# Altium schematic sheet 12_PERIPHERALS.SchDoc: =TitleParameter
size A3; Address: Crete IL; Organization: ASISGUARD; Address1: Kemalpasa, Kemalpasa Cd. No:290 D:292H, 35060 Bornova/Izmir/Turkey
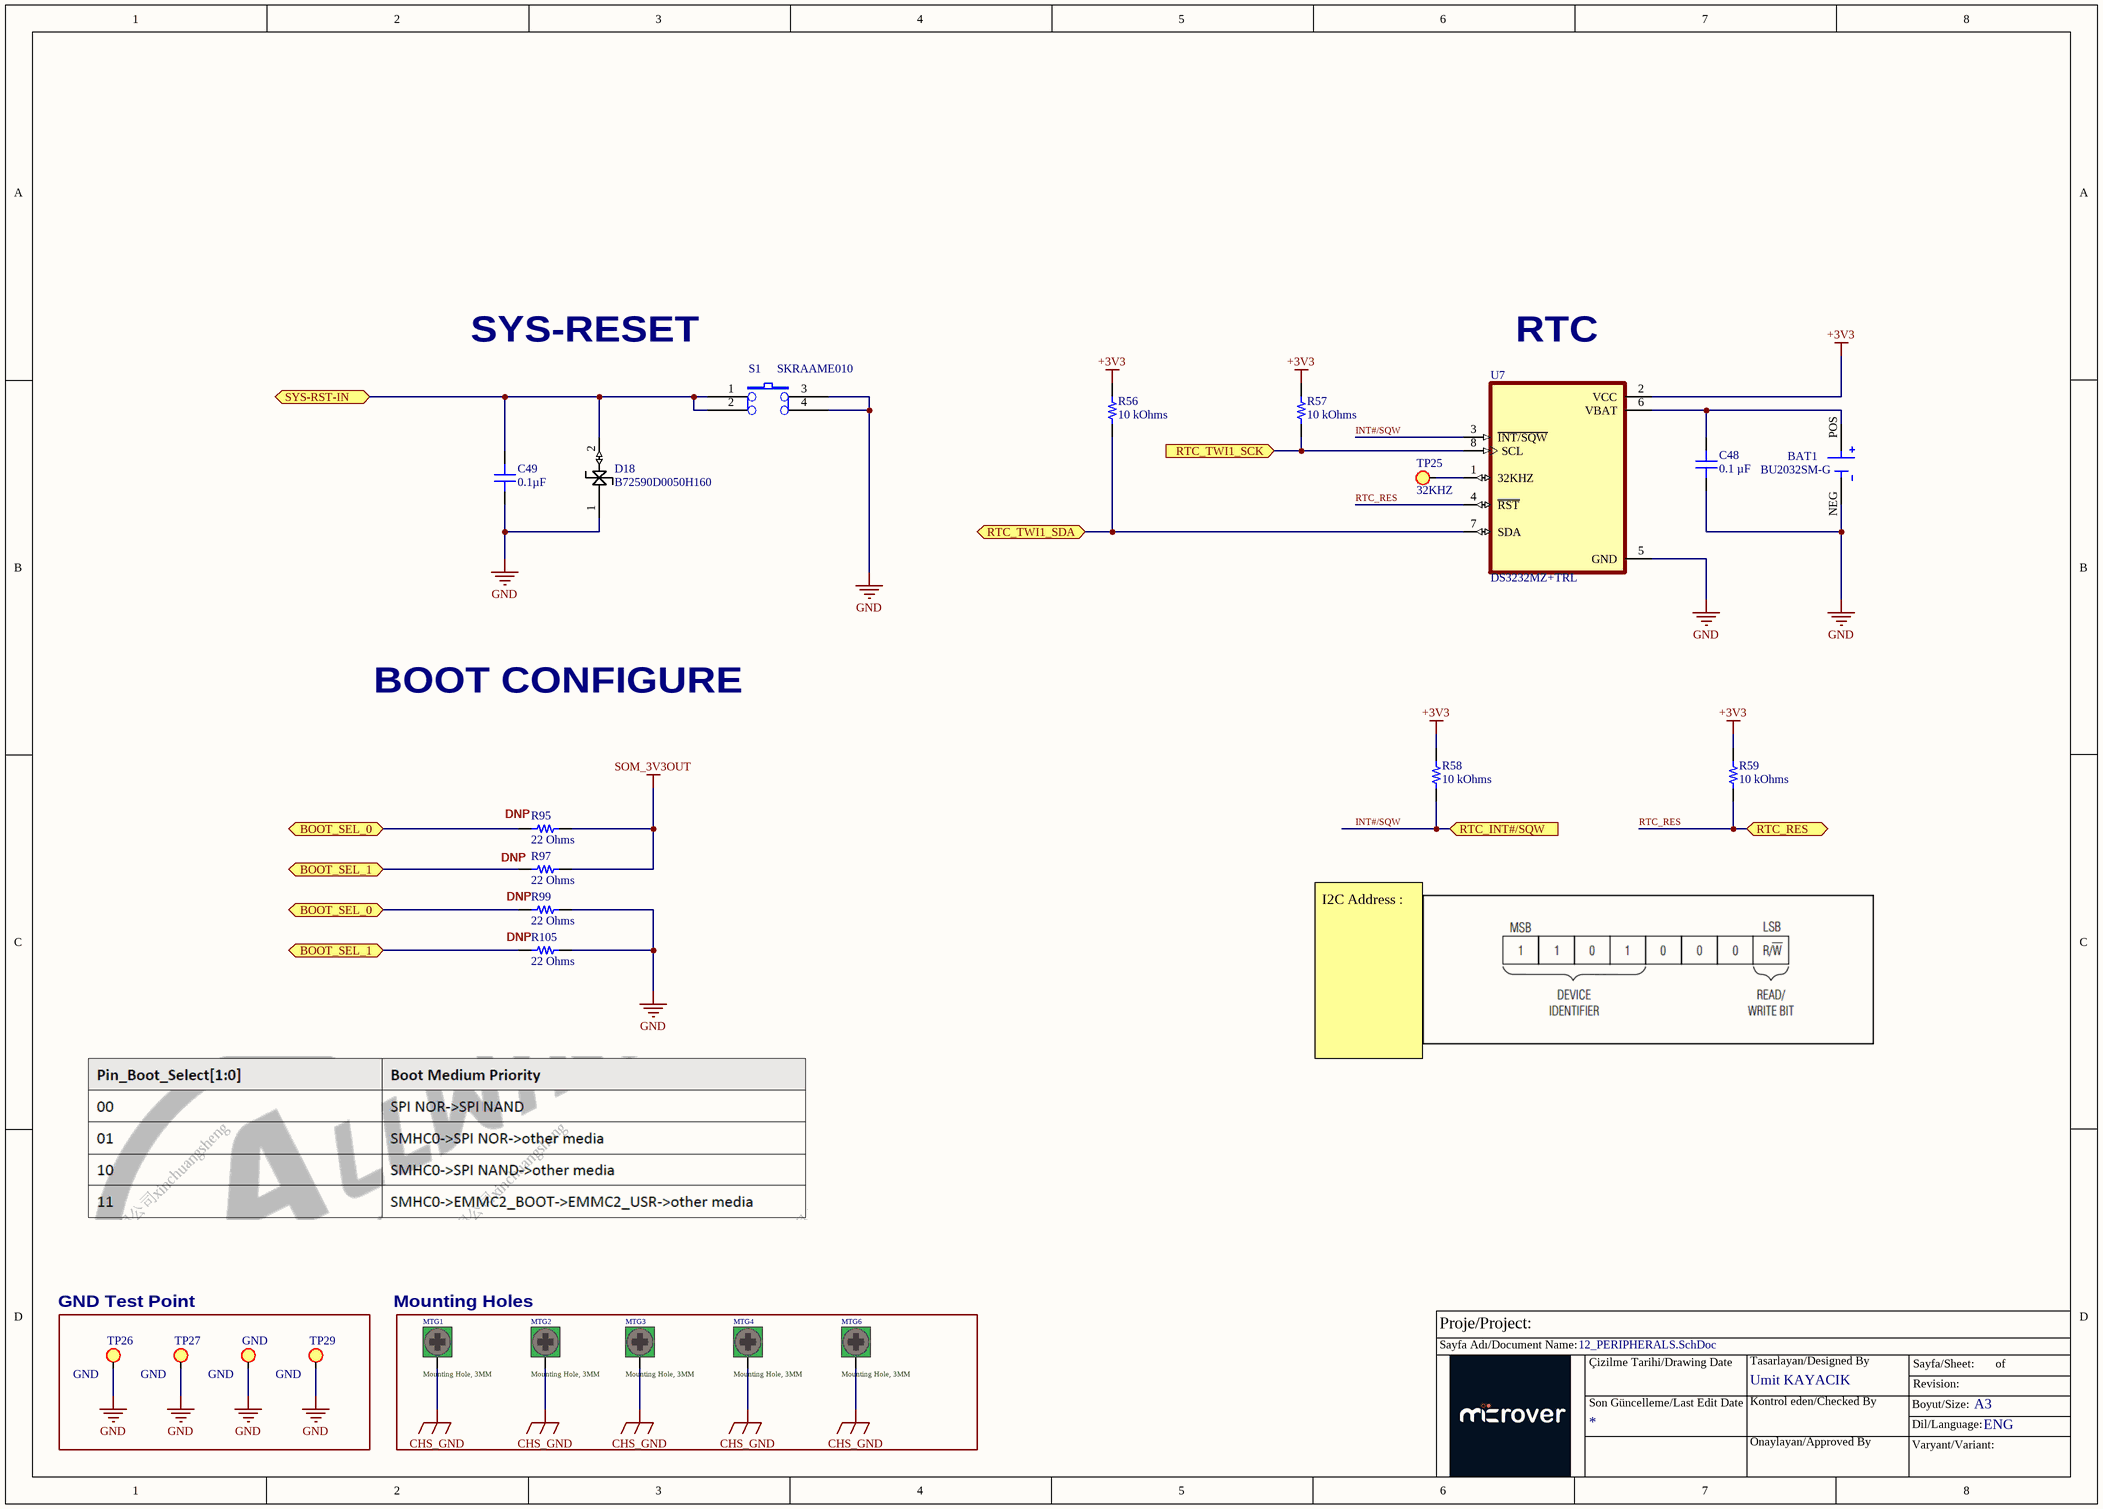
[diagram p0: 12_PERIPHERALS.SchDoc]

## Parts
BAT1  BU2032SM-G  [BAT_BU2032SM-G]
C48  0.1 µF  [CAP 0402_1005]
C49  0.1µF  [CAP 0603_1608]
D18  B72590D0050H160  [SOD1005X60N]
GND  GND  [TEST_POINT]
MTG1  Mounting Hole, 3MM  [MTG-PTH-3MM]  (no BOM)
MTG2  Mounting Hole, 3MM  [MTG-PTH-3MM]  (no BOM)
MTG3  Mounting Hole, 3MM  [MTG-PTH-3MM]  (no BOM)
MTG4  Mounting Hole, 3MM  [MTG-PTH-3MM]  (no BOM)
MTG6  Mounting Hole, 3MM  [MTG-PTH-3MM]  (no BOM)
R56  10 kOhms  [RES 0402_1005]
R57  10 kOhms  [RES 0402_1005]
R58  10 kOhms  [RES 0402_1005]
R59  10 kOhms  [RES 0402_1005]
R95  22 Ohms  [RES 0402_1005]
R97  22 Ohms  [RES 0402_1005]
R99  22 Ohms  [RES 0402_1005]
R105  22 Ohms  [RES 0402_1005]
S1  SKRAAME010  [SKRAAME010 - duplicate]
TP25  32KHZ  [TEST_POINT]
TP26  GND  [TEST_POINT]
TP27  GND  [TEST_POINT]
TP29  GND  [TEST_POINT]
U7  DS3232MZ+TRL  [SOIC127P600X175-8N - duplicate1]

## Blocks framed on the sheet
GND Test Point: GND TP26 TP27 TP29
Mounting Holes: MTG1-MTG4 MTG6

## Ports
BOOT_SEL_0 (bidir), BOOT_SEL_1 (bidir), RTC_INT#/SQW (in), RTC_RES (bidir), RTC_TWI1_SCK (in), RTC_TWI1_SDA (bidir), SYS-RST-IN (bidir)

## Nets
+3V3: R56.2 R57.2 R58.2 R59.2 U7.2(VCC)
CHS_GND: MTG1.0 MTG2.0 MTG3.0 MTG4.0 MTG6.0
GND: BAT1.NEG C48.1 C49.1 D18.1(GND) GND.1(TP) R99.2 R105.2 S1.3 S1.4 TP26.1(TP) TP27.1(TP) TP29.1(TP) U7.5(GND)
SOM_3V3OUT: R95.2 R97.2
BOOT_SEL_0: R95.1 R99.1 ; port BOOT_SEL_0
BOOT_SEL_1: R97.1 R105.1 ; port BOOT_SEL_1
INT#/SQW: R58.1 U7.3(~{INT/SQW}) ; port RTC_INT#/SQW
RTC_RES: R59.1 U7.4(~{RST}) ; port RTC_RES
RTC_TWI1_SCK: R57.1 U7.8(SCL) ; port RTC_TWI1_SCK
RTC_TWI1_SDA: R56.1 U7.7(SDA) ; port RTC_TWI1_SDA
SYS-RST-IN: C49.2 D18.2(I/OLINE) S1.1 S1.2 ; port SYS-RST-IN
NetBAT1_POS: BAT1.POS C48.2 U7.6(VBAT)
NetTP25_1: TP25.1(TP) U7.1(32KHZ)

## Notes on the sheet
- SYS-RESET
- (near U7) RTC
- BOOT CONFIGURE
- (near R95) DNP
- (near R97) DNP
- (near R99) DNP
- (near R105) DNP
- I2C Address :
- Proje/Project:
- Sayfa Adı/Document Name:
- Çizilme Tarihi/Drawing Date
- Umit KAYACIK
- Tasarlayan/Designed By
- Sayfa/Sheet:
- Revision:
- of
- Son Güncelleme/Last Edit Date
- Kontrol eden/Checked By
- Onaylayan/Approved By
- Boyut/Size:
- Varyant/Variant:
- Dil/Language:
- A3
- ENG

## Library data of the parts
BAT1 = BU2032SM-G: Battery Holder Coin 20MM SMD; Manufacturer: Memory Protection Devices; Number of Cells: 1; Number of Contacts: 2NUMBER; Supplier 1: Digikey; Manufacturer Part Number: BU2032SM-G; RoHS: Yes; Category: Uncategorized; Stock 1: 17897; Pricing 1: 400=0.81163, 800=0.76195, 1200=0.71225, 2800=0.646, 10000=0.5963 (USD); Mount: Surface Mount,PCB; Case/Package: SMD/SMT; Contact Material: 153,157ConductorMaterial; Min Operating Temperature: -40°C; Max Operating Temperature: 315°C; Termination: SMD/SMT; Series: -; Packaging: Cut Tape; Height: 5.3mm; ComponentLink1URL: https://datasheet.ciiva.com/7613/bu2032sm-g-datasheet-7613472.pdf?src-supplier=Digikey; ComponentLink1Description: https://datasheet.ciiva.com/7613/bu2032sm-g-datasheet-7613472.pdf?src-supplier=Digikey; Supplier Part Number 1: BU2032SM-GTR-ND
C48 = 885012105001: CAP CER 0.1UF 6.3V X5R 0402; manufacturer: Würth Elektronik; Tolerance: ±20%; Part Number: 885012105001; Value: 0.1 µF; Applications: General Purpose; Capacitance: 0.1 µF; componentlink1description: Datasheet; componentlink1url: https://katalog.we-online.de/pbs/datasheet/885012105001.pdf; componentlink2description: DigiKey Link; componentlink2url: https://www.digikey.com/en/products/detail/würth-elektronik/885012105001/5453333; Device Package: 0402 (1005 Metric); lastupdated: 2/9/2024 8:04:37 PM; Lifecycle Status: Active; Minimum Order: 1; Mounting Type: Surface Mount, MLCC; Operating Temperature: -55°C ~ 85°C; Package / Case: 0402 (1005 Metric); packaging: TapeAndReel; partid: 1931; Part Status: Active; price: 0.01; series: WCAP-CSGP; Size / Dimension: 0.039" L x 0.020" W (1.00mm x 0.50mm); Supplier 1: DigiKey; Supplier Part Number 1: 732-7478-1-ND; Temperature Coefficient: X5R; Thickness (Max): 0.022" (0.55mm); Voltage - Rated: 6.3V
C49 = ESD35C104K4T2A-24: CAP CER 0.1UF 50V X7R 0603; manufacturer: AVX Corporation; Tolerance: ±10%; Part Number: ESD35C104K4T2A-24; Value: 0.1µF; Applications: Automotive, ESD Protection; Capacitance: 0.1µF; componentlink1description: Datasheet; componentlink1url: http://datasheets.avx.com/ESDSafe.pdf; componentlink2description: DigiKey Link; componentlink2url: http://digikey.com/product-detail/en/avx-corporation/ESD35C104K4T2A-24/478-8009-1-ND/3902999; Device Package: 0603 (1608 Metric); lastupdated: 9/2/2020 1:03:10 AM; Lifecycle Status: Active; Minimum Order: 1; Mounting Type: Surface Mount, MLCC; Operating Temperature: -55°C ~ 125°C; Package / Case: 0603 (1608 Metric); packaging: TapeAndReel; partid: 15342; Part Status: Active; price: 0.03; Ratings: AEC-Q200; series: ESD-SAFE™; Size / Dimension: 0.063" L x 0.031" W (1.60mm x 0.80mm); Supplier 1: DigiKey; Supplier Part Number 1: 478-8009-1-ND; Temperature Coefficient: X7R; Voltage - Rated: 50V
D18 = B72590D0050H160: VARISTOR 150V 0402; Manufacturer: TDK EPCOS; Supplier 1: Digikey; Manufacturer Part Number: B72590D0050H160; RoHS: Yes; Category: Varistors; Stock 1: 130000; Pricing 1: 10000=0,04977, 30000=0,04666, 50000=0,04137, 100000=0,04044, 250000=0,03982 (USD); ComponentLink1URL: https://datasheet.octopart.com/B72590D0050H160-EPCOS-datasheet-10468447.pdf?src-supplier=Newark; ComponentLink1Description: https://datasheet.octopart.com/B72590D0050H160-EPCOS-datasheet-10468447.pdf?src-supplier=Newark; ComponentLink2URL: https://en.tdk.eu/inf/75/ds/High_speed_series.pdf?src-supplier=Verical; ComponentLink2Description: https://en.tdk.eu/inf/75/ds/High_speed_series.pdf?src-supplier=Verical; ComponentLink3URL: http://www.farnell.com/datasheets/1706828.pdf?src-supplier=Newark; ComponentLink3Description: http://www.farnell.com/datasheets/1706828.pdf?src-supplier=Newark; ComponentLink4URL: https://en.tdk.eu/inf/75/ds/High_speed_series.pdf?src-supplier=Digikey; ComponentLink4Description: https://en.tdk.eu/inf/75/ds/High_speed_series.pdf?src-supplier=Digikey; ComponentLink5URL: https://www.tdk-electronics.tdk.com/inf/75/ds/High_speed_series.pdf?src-supplier=Digikey; ComponentLink5Description: https://www.tdk-electronics.tdk.com/inf/75/ds/High_speed_series.pdf?src-supplier=Digikey; ComponentLink6URL: https://en.tdk.eu/inf/75/ds/High_speed_series.pdf?src-supplier=Arrow+Electronics; ComponentLink6Description: https://en.tdk.eu/inf/75/ds/High_speed_series.pdf?src-supplier=Arrow+Electronics; ComponentLink7URL: https://en.tdk.eu/inf/75/ds/High_speed_series.pdf?src-supplier=Quest; ComponentLink7Description: https://en.tdk.eu/inf/75/ds/High_speed_series.pdf?src-supplier=Quest; ComponentLink8URL: https://datasheet.octopart.com/B72590D0050H160-EPCOS-datasheet-157245974.pdf?src-supplier=LKR; ComponentLink8Description: https://datasheet.octopart.com/B72590D0050H160-EPCOS-datasheet-157245974.pdf?src-supplier=LKR; ComponentLink9URL: https://en.tdk.eu/inf/75/ds/High_speed_series.pdf?src-supplier=TTI; ComponentLink9Description: https://en.tdk.eu/inf/75/ds/High_speed_series.pdf?src-supplier=TTI; Supplier Part Number 1: 495-3684-2-ND
GND TP25-TP27 TP29 = TP_1
MTG1-MTG4 MTG6 = MTG3MM
R56-R59 = RP73PF1E10KBTD: RES 10K OHM 0.1% 1/10W 0402; Manufacturer: TE Connectivity Passive Product; Power (Watts): 0.1W, 1/10W; Temperature Coefficient: ±25ppm/°C; Part Number: RP73PF1E10KBTD; Value: 10 kOhms; ComponentLink1Description: Datasheet; ComponentLink1URL: https://www.te.com/commerce/DocumentDelivery/DDEController?Action=srchrtrv&DocNm=1773272&DocType=DS&DocLang=English; ComponentLink2Description: DigiKey Link; ComponentLink2URL: https://www.digikey.com/en/products/detail/te-connectivity-passive-product/RP73PF1E10KBTD/8260957; Composition: Thin Film; Device Package: 0402 (1005 Metric); Height - Seated (Max): 0.014" (0.35mm); LastUpdated: 2/9/2024 8:30:24 PM; Lifecycle Status: Active; Minimum Order: 1; Number of Terminations: 2; Operating Temperature: -55°C ~ 155°C; Package / Case: 0402 (1005 Metric); Packaging: TapeAndReel; PartId: 2434; Part Status: Active; Price: 0.08; Resistance: 10 kOhms; Series: RP73, Holsworthy; Size / Dimension: 0.039" L x 0.020" W (1.00mm x 0.50mm); Supplier 1: DigiKey; Supplier Part Number 1: A127415CT-ND; Supplier Device Package: 0402; Tolerance: ±0.1%
R95 R97 R99 R105 = RC0402FR-0722RP: RES 22 OHM 1% 1/16W 0402; Manufacturer: Yageo; Power (Watts): 0.063W, 1/16W; Ratings: 7C1 RoHS w/out Exemption (100% Pb-Free); Temperature Coefficient: ±100ppm/°C; Part Number: RC0402FR-0722RP; Value: 22 Ohms; ComponentLink1Description: Datasheet; ComponentLink1URL: http://www.yageo.com/NewPortal/yageodocoutput?fileName=/pdf/R-Chip/PYu-RC_51_RoHS_P_0.pdf; ComponentLink2Description: DigiKey Link; ComponentLink2URL: https://www.digikey.com/en/products/detail/yageo/RC0402FR-0722RP/4935272; Composition: Thick Film; Device Package: 0402 (1005 Metric); Features: Moisture Resistant; Height - Seated (Max): 0.016" (0.40mm); LastUpdated: 2/9/2024 8:29:38 PM; Lifecycle Status: Active; Minimum Order: 1; Number of Terminations: 2; Operating Temperature: -55°C ~ 155°C; Package / Case: 0402 (1005 Metric); Packaging: CutTape; PartId: 16168; Part Status: Active; Price: 0.01; Resistance: 22 Ohms; Series: RC_P; Size / Dimension: 0.039" L x 0.020" W (1.00mm x 0.50mm); Supplier 1: DigiKey; Supplier Part Number 1: YAG1257CT-ND; Supplier Device Package: 0402; Tolerance: ±1%
S1 = SKRAAME010: Key,6.2mm Square with Middle-travel,0.5mm,50mA,12V DC,¨C40~£«90¡æ,1.96N,SMT,ALPS; Myir P/N: 21201.00008; PCB Footprint: SKRAAME010; Part Type: Key; Manufacturer: ALPS; Manufacturer P/N: SKRAAME010; Reserve Value: SKRAAME010; Datasheet: Connector\Key_ALPS_skra.pdf
U7 = DS3232MZ+TRL: Real Time Clock (RTC) IC Clock/Calendar 236B I²C, 2-Wire Serial 8-SOIC (0.154, 3.90mm Width); Manufacturer: Maxim; Supplier 1: Digikey; Manufacturer Part Number: DS3232MZ+TRL; RoHS: Yes; Category: Real Time Clocks; Stock 1: 40000; Pricing 1: 2500=5.252 (USD); ComponentLink1URL: https://datasheet.ciiva.com/12291/ds3232m-95532-12291172.pdf?src-supplier=Mouser; ComponentLink1Description: https://datasheet.ciiva.com/12291/ds3232m-95532-12291172.pdf?src-supplier=Mouser; ComponentLink2URL: https://datasheet.ciiva.com/14085/ds3232m-14085670.pdf?src-supplier=Digikey; ComponentLink2Description: https://datasheet.ciiva.com/14085/ds3232m-14085670.pdf?src-supplier=Digikey; ComponentLink3URL: https://datasheet.ciiva.com/14196/ds3232m-14196620.pdf?src-supplier=Avnet; ComponentLink3Description: https://datasheet.ciiva.com/14196/ds3232m-14196620.pdf?src-supplier=Avnet; Supplier Part Number 1: DS3232MZ+TRLTR-ND